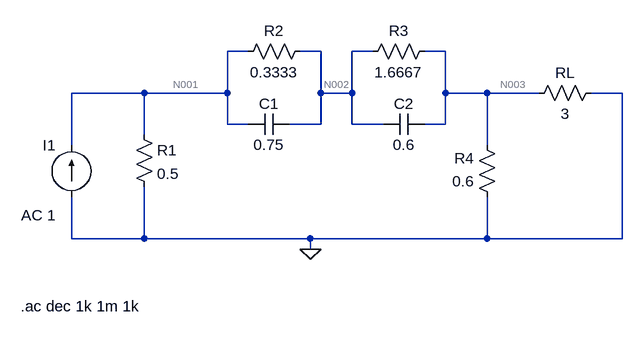
[diagram p0: schematic Ej1.asc]
Ej1.asc, the LTspice schematic file:
Version 4
SHEET 1 880 680
WIRE 176 0 144 0
WIRE 288 0 256 0
WIRE 368 0 336 0
WIRE 480 0 448 0
WIRE 16 64 -96 64
WIRE 144 64 144 0
WIRE 144 64 16 64
WIRE 288 64 288 0
WIRE 336 64 336 0
WIRE 336 64 288 64
WIRE 480 64 480 0
WIRE 544 64 480 64
WIRE 624 64 544 64
WIRE 752 64 704 64
WIRE 144 112 144 64
WIRE 176 112 144 112
WIRE 288 112 288 64
WIRE 288 112 240 112
WIRE 336 112 336 64
WIRE 384 112 336 112
WIRE 480 112 480 64
WIRE 480 112 448 112
WIRE 16 128 16 64
WIRE -96 144 -96 64
WIRE 544 144 544 64
WIRE -96 288 -96 224
WIRE 16 288 16 208
WIRE 16 288 -96 288
WIRE 272 288 16 288
WIRE 544 288 544 224
WIRE 544 288 272 288
WIRE 752 288 752 64
WIRE 752 288 544 288
WIRE 272 304 272 288
FLAG 272 304 0
SYMBOL res 0 112 R0
SYMATTR InstName R1
SYMATTR Value 0.5
SYMBOL res 272 -16 R90
WINDOW 0 0 56 VBottom 2
WINDOW 3 32 56 VTop 2
SYMATTR InstName R2
SYMATTR Value 0.3333
SYMBOL res 464 -16 R90
WINDOW 0 0 56 VBottom 2
WINDOW 3 32 56 VTop 2
SYMATTR InstName R3
SYMATTR Value 1.6667
SYMBOL res 560 240 R180
WINDOW 0 36 76 Left 2
WINDOW 3 36 40 Left 2
SYMATTR InstName R4
SYMATTR Value 0.6
SYMBOL res 608 80 R270
WINDOW 0 32 56 VTop 2
WINDOW 3 0 56 VBottom 2
SYMATTR InstName RL
SYMATTR Value 3
SYMBOL cap 240 96 R90
WINDOW 0 0 32 VBottom 2
WINDOW 3 32 32 VTop 2
SYMATTR InstName C1
SYMATTR Value 0.75
SYMBOL cap 448 96 R90
WINDOW 0 0 32 VBottom 2
WINDOW 3 32 32 VTop 2
SYMATTR InstName C2
SYMATTR Value 0.6
SYMBOL current -96 224 R180
WINDOW 0 24 80 Left 2
WINDOW 3 24 0 Left 2
WINDOW 123 24 -28 Left 2
WINDOW 39 0 0 Left 0
SYMATTR InstName I1
SYMATTR Value ""
SYMATTR Value2 AC 1
TEXT -174 392 Left 2 !.ac dec 1k 1m 1k

The netlist it stands for:
* Ej1.asc
R1 N001 0 0.5
R2 N002 N001 0.3333
R3 N003 N002 1.6667
R4 0 N003 0.6
RL N003 0 3
C1 N002 N001 0.75
C2 N003 N002 0.6
I1 0 N001 AC 1
.ac dec 1k 1m 1k
.backanno
.end

* Results of the author's LTspice run, read from the files saved beside the schematic
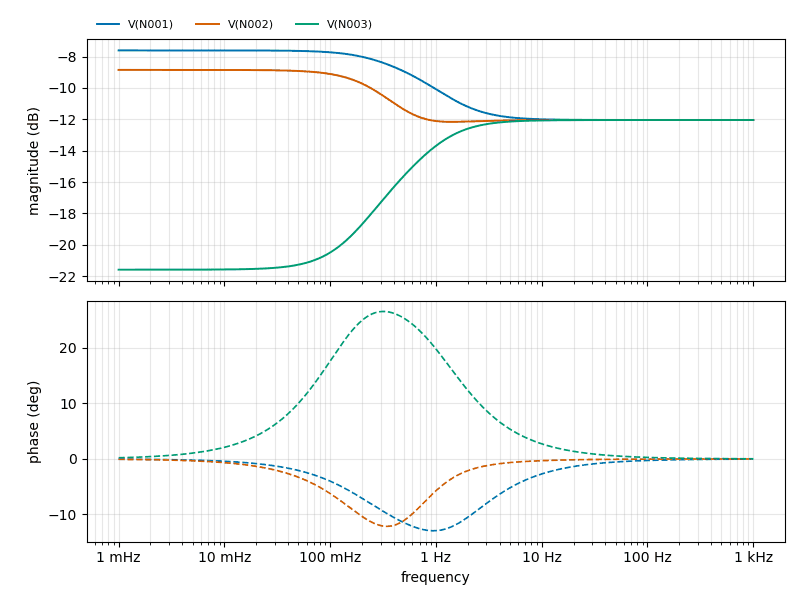
[diagram p1: AC Analysis of Ej1.asc, plotted from the saved traces]
* AC Analysis, 1 run:
*   V(N001): -7.60 dB at 1 mHz, -12.04 dB at 1 kHz, peak -7.60 dB at 1 mHz, 3 dB below the peak at 1.355 Hz
*   V(N002): -8.85 dB at 1 mHz, -12.04 dB at 1 kHz, peak -8.85 dB at 1 mHz, 3 dB below the peak at 699.1 mHz
*   V(N003): -21.58 dB at 1 mHz, -12.04 dB at 1 kHz, peak -12.04 dB at 1 kHz, 3 dB below the peak at 595.5 mHz